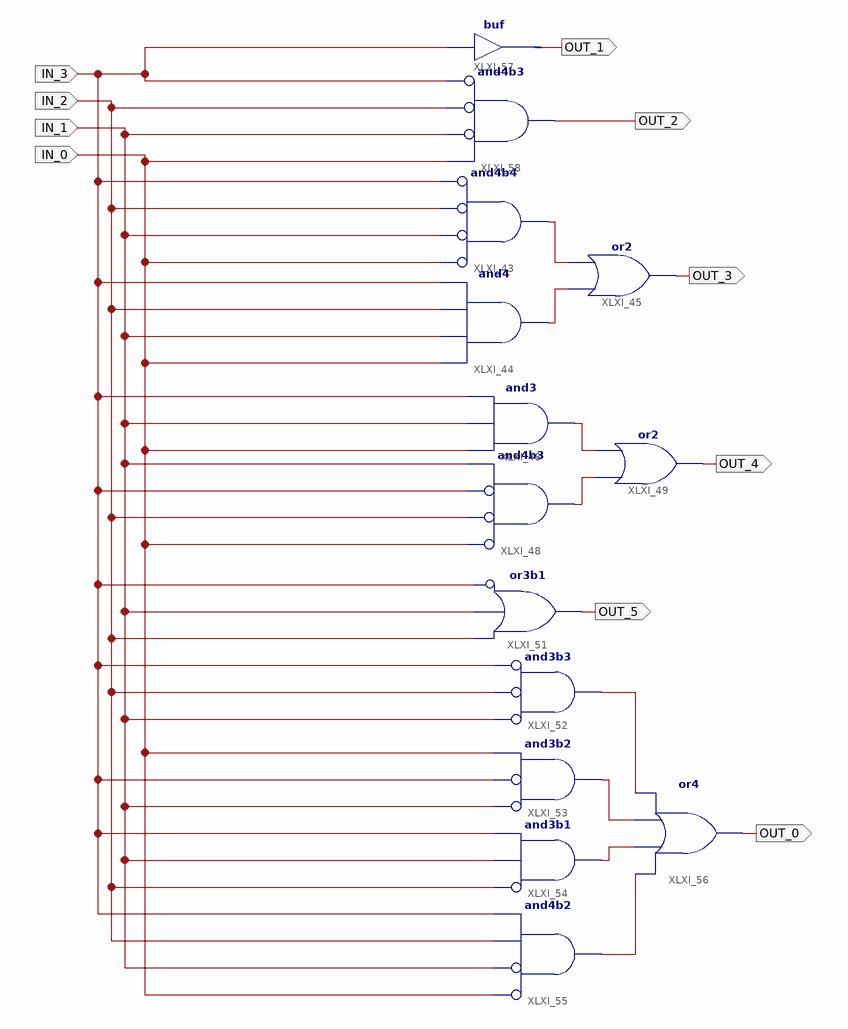
[diagram p0: schematic sheet 1]
// Xilinx ISE schematic My2To4Decoder.sch (spartan3a) as structural Verilog: 14 symbols, 10 ports
module My2To4Decoder (
  input  IN_2,
  input  IN_1,
  input  IN_0,
  input  IN_3,
  output OUT_1,
  output OUT_3,
  output OUT_4,
  output OUT_5,
  output OUT_0,
  output OUT_2
);

  wire XLXN_97, XLXN_99, XLXN_116, XLXN_117, XLXN_132, XLXN_133, XLXN_135, XLXN_136;

  and XLXI_43 (XLXN_97, ~IN_0, ~IN_1, ~IN_2, ~IN_3);  // and4b4
  and XLXI_44 (XLXN_99, IN_0, IN_1, IN_2, IN_3);
  or XLXI_45 (OUT_3, XLXN_99, XLXN_97);
  and XLXI_46 (XLXN_117, IN_0, IN_1, IN_3);
  and XLXI_48 (XLXN_116, ~IN_0, ~IN_2, ~IN_3, IN_1);  // and4b3
  or XLXI_49 (OUT_4, XLXN_116, XLXN_117);
  or XLXI_51 (OUT_5, ~IN_3, IN_1, IN_2);  // or3b1
  and XLXI_52 (XLXN_132, ~IN_1, ~IN_2, ~IN_3);  // and3b3
  and XLXI_53 (XLXN_133, ~IN_1, ~IN_3, IN_0);  // and3b2
  and XLXI_54 (XLXN_135, ~IN_2, IN_1, IN_3);  // and3b1
  and XLXI_55 (XLXN_136, ~IN_0, ~IN_1, IN_2, IN_3);  // and4b2
  or XLXI_56 (OUT_0, XLXN_136, XLXN_135, XLXN_133, XLXN_132);
  buf XLXI_57 (OUT_1, IN_3);
  and XLXI_58 (OUT_2, ~IN_3, ~IN_2, ~IN_1, IN_0);  // and4b3
endmodule
